# Altium schematic sheet Main.SchDoc
size A; SheetNumber: 1; SheetTotal: 8
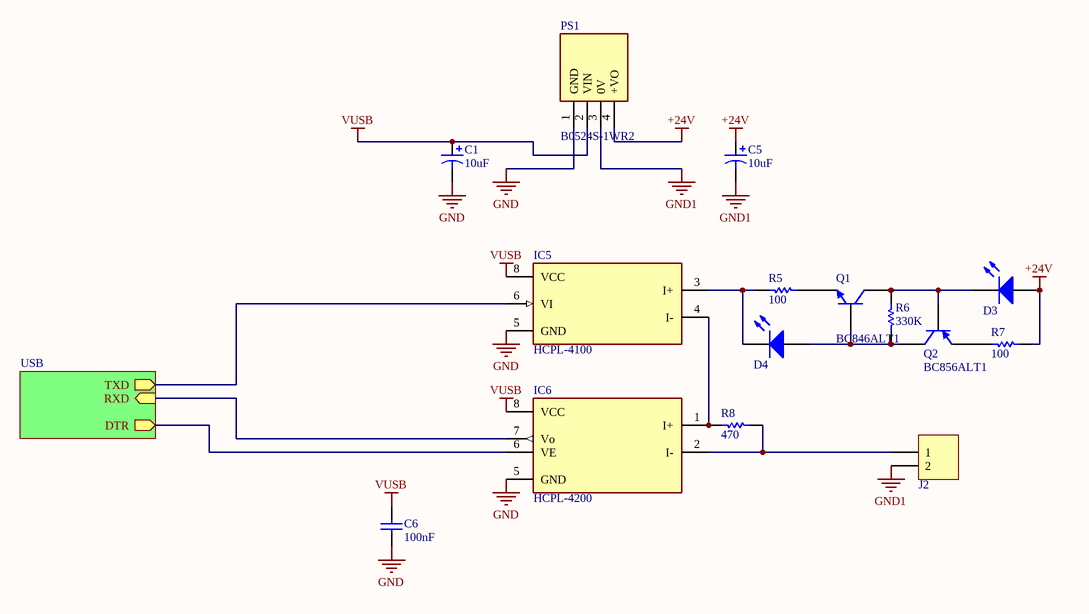
[diagram p0: Main.SchDoc]

## Parts
C1  10uF  [CAP-TAN-A]
C5  10uF  [CAP-TAN-A]
C6  100nF  [C603]
D3  LED  [LED-0603]  (value not drawn)
D4  LED  [LED-0603]  (value not drawn)
IC5  HCPL-4100  [SOP-8]
IC6  HCPL-4200  [SOP-8]
J2  CONN-2  [phonix-2]  (value not drawn)
PS1  B0524S-1WR2  [B0524S1WR2]
Q1  BC846ALT1  [SOT-23]
Q2  BC856ALT1  [SOT-23]
R5  100  [r0603]
R6  330K  [r0603]
R7  100  [r0603]
R8  470  [R805]

## Sub-sheets
USB = ft232.SchDoc: RXD (in), TXD (out), DTR (out)

## Nets
+24V: C5.1 D3.1(A) PS1.4(+VO) R7.2
GND: C1.2 C6.1 IC5.5(GND) IC6.5(GND) PS1.1(GND)
GND1: C5.2 J2.2 PS1.3(0V)
VUSB: C1.1 C6.2 IC5.8(VCC) IC6.8(VCC) PS1.2(VIN)
NetD3_2: D3.2(K) Q1.3(C) Q2.1(B) R6.1
NetD4_1: D4.1(A) Q1.1(B) Q2.3(C) R6.2
NetD4_2: D4.2(K) IC5.3(I+) R5.1
NetIC5_4: IC5.4(I-) IC6.1(I+) R8.2
NetIC5_6: IC5.6(VI) ; sheet USB/TXD
NetIC6_2: IC6.2(I-) J2.1 R8.1
NetIC6_6: IC6.6(VE) ; sheet USB/DTR
NetIC6_7: IC6.7(Vo) ; sheet USB/RXD
NetQ1_2: Q1.2(E) R5.2
NetQ2_2: Q2.2(E) R7.1

## Library data of the parts
C1 C5 = CAP-POL: Polar Capacitor; Voltage: 10V; Value: 10uF
C6 = Cap: Capacitor; Designer: Parsa Malekpour; Value: 100nF
IC5 = HCPL-4100: <b>Isolation Amplifer</b><p> Source: http://www.avagotech.com/docs/AV02-0410EN; MF: {'manufacturer': u'Broadcom Limited'}; Package: None; Value: *; Price: None; MP: HCPL-4100; Availability: Unavailable
IC6 = HCPL-4200: Optically Coupled 20 mA Current Loop Receiver; MF: {'manufacturer': u'Broadcom Limited'}; Package: None; Value: *; Price: None; MP: HCPL-4100; Availability: Unavailable
PS1 = B0524S-1WR2: Power Supply; Manufacturer_Name: Mornsun Power; Datasheet Link: https://www.mornsun-power.com/public/uploads/pdf/B_D-1WR2.pdf; Height: 10.16mm; Manufacturer_Part_Number: B0524S-1WR2
Q1 = BC846ALT1: General Purpose Transistor NPN Silicon; Published: 29-Sep-2000; LatestRevisionDate: 17-Jul-2002; LatestRevisionNote: Re-released for DXP Platform.; DatasheetVersion: 1997; PackageVersion: 1997; PackageReference: 318-08; Publisher: Altium Limited; PackageDescription: SOT-23; 3 Leads; Body 3.0 x 2.6 mm, inc. leads (LxW max); ComponentLink1Description: Manufacturer Link; ComponentLink1URL: http://www.onsemi.com/site/products/landing?taxonomyID=194; ComponentLink2Description: Datasheet; ComponentLink2URL: http://www.onsemi.com/pub/Collateral/BC846ALT1-D.PDF
Q2 = BC856ALT1: General Purpose Transistor PNP Silicon; Published: 29-Sep-2000; LatestRevisionDate: 17-Jul-2002; LatestRevisionNote: Re-released for DXP Platform.; DatasheetVersion: 1997; PackageVersion: 1997; PackageReference: 318-08; Publisher: Altium Limited; PackageDescription: SOT-23; 3 Leads; Body 3.0 x 2.6 mm, inc. leads (LxW max); ComponentLink1Description: Manufacturer Link; ComponentLink1URL: http://www.onsemi.com/site/products/landing?taxonomyID=194; ComponentLink2Description: Datasheet; ComponentLink2URL: http://www.onsemi.com/pub/Collateral/BC856ALT1-D.PDF
R5-R8 = Resistor: Designer: Parsa Malekpour
  R5 R7: Value: 100
  R6: Value: 330K
  R8: Value: 470